# Altium project NixieMultimeterFront.PrjPcb
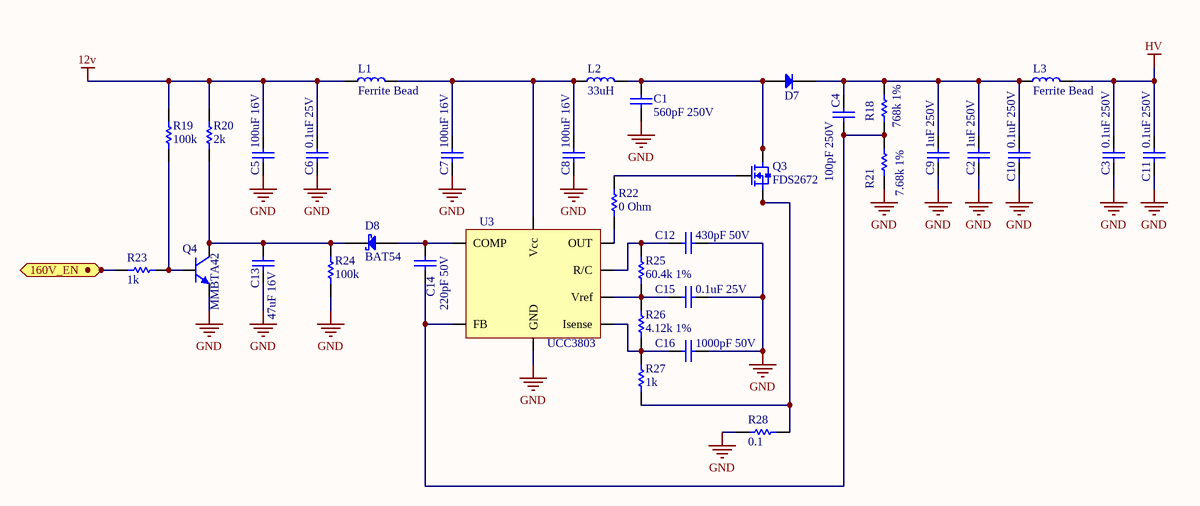
[diagram p0: Boost.SchDoc]
2 sheets, 45 parts. Net scope: flat (ports and power ports of the same name join across sheets).
Sheets:
  Boost.SchDoc
  Nixie.SchDoc

## Sheet Boost.SchDoc
size A

### Parts
C1  560pF 250V  [C0603]
C2  1uF 250V  [C2220]
C3  0.1uF 250V  [C0805]
C4  100pF 250V  [C0805]
C5  100uF 16V  [C1210]
C6  0.1uF 25V  [C0805]
C7  100uF 16V  [C1210]
C8  100uF 16V  [C1210]
C9  1uF 250V  [C2220]
C10  0.1uF 250V  [C0805]
C11  0.1uF 250V  [C0805]
C12  430pF 50V  [C0805]
C13  47uF 16V  [C1206]
C14  220pF 50V  [C0805]
C15  0.1uF 25V  [C0805]
C16  1000pF 50V  [C0805]
D7  Diode  [SMA]  (value not drawn)
D8  BAT54  [SOD-323]
L1  Ferrite Bead  [R0805]
L2  33uH  [Wurth 7447709330]
L3  Ferrite Bead  [R0805]
Q3  FDS2672  [8-SOIC]
Q4  MMBTA42  [SOT_23]
R18  768k 1%  [R0805]
R19  100k  [R0603]
R20  2k  [R0805]
R21  7.68k 1%  [R0805]
R22  0 Ohm  [R0805]
R23  1k  [R0805]
R24  100k  [R0603]
R25  60.4k 1%  [R0805]
R26  4.12k 1%  [R0805]
R27  1k  [R0805]
R28  0.1  [R0805]
U3  UCC3803  [8-SOIC]

### Ports
160V_EN

### Nets
12v: C5.2 C6.2 L1.1 R19.2 R20.2
GND: C1.1 C2.1 C3.1 C5.1 C6.1 C7.1 C8.1 C9.1 C10.1 C11.1 C12.2 C13.1 C15.2 C16.1 Q4.3(E) R21.1 R24.1 R28.1 U3.5(GND)
HV: C3.2 C11.2 L3.2
NetC1_2: C1.2 D7.1(A) L2.2 Q3.5 Q3.6 Q3.7 Q3.8
NetC2_2: C2.2 C4.2 C9.2 C10.2 D7.2(K) L3.1 R18.2
NetC4_1: C4.1 C14.1 R18.1 R21.2 U3.2(FB)
NetC7_2: C7.2 C8.2 L1.2 L2.1 U3.7(Vcc)
NetC12_1: C12.1 R25.1 U3.4(R/C)
NetC13_2: C13.2 D8.2(K) Q4.1(C) R20.1 R24.2
NetC14_2: C14.2 D8.1(A) U3.1(COMP)
NetC15_1: C15.1 R25.2 R26.1 U3.8(Vref)
NetC16_2: C16.2 R26.2 R27.1 U3.3(Isense)
NetQ3_1: Q3.1 Q3.2 Q3.3 R27.2 R28.2
NetQ3_4: Q3.4 R22.2
NetQ4_2: Q4.2(B) R19.1 R23.2
NetR22_1: R22.1 U3.6(OUT)
NetR23_1: R23.1 ; port 160V_EN

### Library data of the parts
C1 = 560pF 250V 0603: CAP CER 560PF 250V C0G/NP0 0603; Supplier 1: Digi-Key; Supplier Part Number 1: 399-11888-1-ND
C2 C9 = 1uF 250V 2220: CAP CER 1UF 250V X7R 2220; Supplier 1: Digi-Key; Supplier Part Number 1: 490-3550-1-ND
C3 C10 C11 = 0.1uF 250V 0805: CAP CER 0.1UF 250V X7T 0805; Supplier 1: Digi-Key; Supplier Part Number 1: 445-7965-1-ND
C4 = 100pF 250V 0805: CAP CER 100PF 250V C0G/NP0 0805; Supplier 1: Digi-Key; Supplier Part Number 1: 399-15000-1-ND
C5 C7 C8 = 100uF 16V 1210: CAP CER 100UF 16V X5R 1210; Supplier 1: Digi-Key; Supplier Part Number 1: 587-5426-1-ND
C6 C15 = 0.1uF 25V 0805: CAP CER 0.1UF 25V Y5V 0805; Supplier 1: Digi-Key; Supplier Part Number 1: 1276-1286-1-ND
C12 = 430pF 50V 0805: CAP CER 430PF 50V C0G/NP0 0805; Supplier 1: Digi-Key; Supplier Part Number 1: 1276-2659-1-ND
C13 = 47uF 16V 1206: CAP CER 47UF 16V JB 1206; Supplier 1: Digi-Key; Supplier Part Number 1: 445-11695-1-ND
C14 = 220pF 50V 0805: CAP CER 220PF 50V X7R 0805; Supplier 1: Digi-Key; Supplier Part Number 1: 399-8039-1-ND
C16 = 1000pF 50V 0805: CAP CER 1000PF 50V X7R 0805; Supplier 1: Digi-Key; Supplier Part Number 1: 399-1147-1-ND
D7 = Diode 200V 1A: DIODE GEN PURP 200V 1A SMA; Supplier 1: Digi-Key; Supplier Part Number 1: ES1DFSCT-ND
D8 = Diode 30V 100mA: DIODE BAT54 SCHOTTKY 30V 100MA SOD323; Supplier 1: Digi-Key; Supplier Part Number 1: BAT54WS-FDICT-ND
L1 L3 = Ferrite Bead 60 Ohm: FERRITE BEAD 60 OHM 0805 1LN; Supplier 1: Digi-Key; Supplier Part Number 1: 587-1932-1-ND
L2 = 33uH: FIXED IND 33UH 4.2A 45 MOHM SMD; Supplier 1: Digi-Key; Supplier Part Number 1: 732-1244-1-ND
Q3 = N-FET FDS2672: MOSFET N-CH 200V 3.9A 8-SOIC; Supplier 1: Digi-Key; Supplier Part Number 1: FDS2672CT-ND
Q4 = NPN 300V 0.3A: TRANS MMBTA42 NPN 300V 0.3A SOT23; Supplier 1: Digi-Key; Supplier Part Number 1: MMBTA42TPMSCT-ND
R18 = 768k 0805 1%: RES SMD 768K OHM 1% 1/8W 0805; Supplier 1: Digi-Key; Supplier Part Number 1: 311-768KCRCT-ND
R19 R24 = 100k 0603 5%: RES SMD 100K OHM 5% 1/10W 0603; Supplier 1: Digi-Key; Supplier Part Number 1: 311-100KGRCT-ND
R20 = 2k 0805 5%: RES SMD 2K OHM 5% 1/8W 0805; Supplier 1: Digi-Key; Supplier Part Number 1: RMCF0805JT2K00CT-ND
R21 = 7.68k 0805 1%: RES SMD 7.68K OHM 1% 1/8W 0805; Supplier 1: Digi-Key; Supplier Part Number 1: 311-7.68KCRCT-ND
R22 = 0 Ohm 0805: RES SMD 0 OHM JUMPER 1/8W 0805; Supplier 1: Digi-Key; Supplier Part Number 1: RMCF0805ZT0R00CT-ND
R23 R27 = 1k 0805 5%: RES SMD 1K OHM 5% 1/8W 0805; Supplier 1: Digi-Key; Supplier Part Number 1: RMCF0805JT1K00CT-ND
R25 = 60.4k 0805 1%: RES SMD 60.4K OHM 1% 1/8W 0805; Supplier 1: Digi-Key; Supplier Part Number 1: 311-60.4KCRCT-ND
R26 = 4.12k 0805 1%: RES SMD 4.12K OHM 1% 1/8W 0805; Supplier 1: Digi-Key; Supplier Part Number 1: 311-4.12KCRCT-ND
R28 = 0.1 0805 1%: RES 0.1 OHM 1% 1/2W 0805; Supplier 1: Digi-Key; Supplier Part Number 1: P19308CT-ND
U3 = UCC3803DTR: IC REG CTRLR MULT TOPOLOGY 8SOIC; Supplier 1: Digi-Key; Supplier Part Number 1: 296-38327-1-ND

## Sheet Nixie.SchDoc
size A
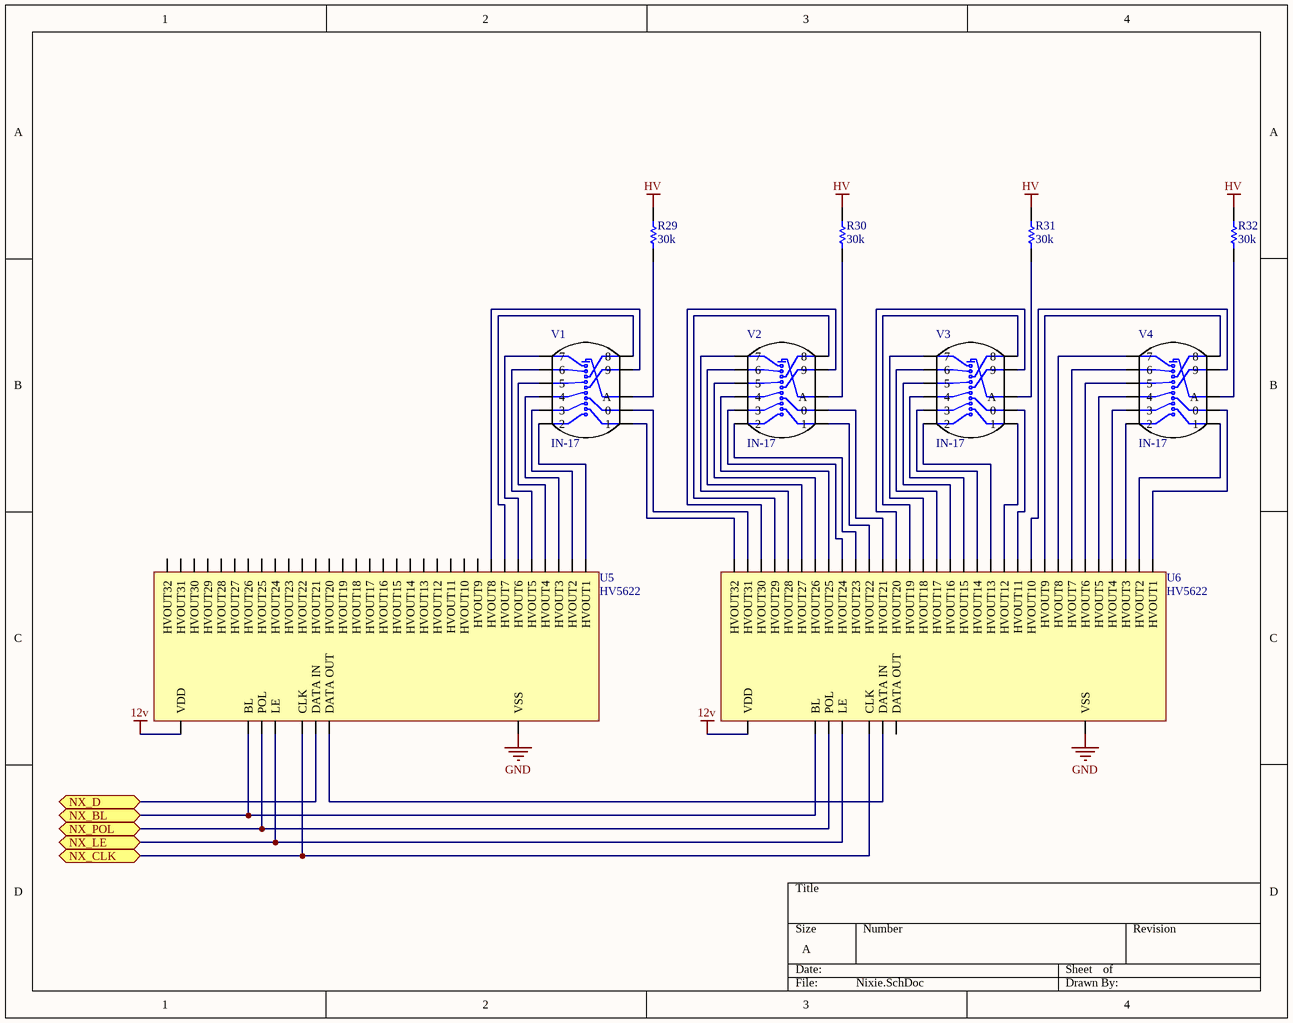
[diagram p1: Nixie.SchDoc]

### Parts
R29  30k  [R0805]
R30  30k  [R0805]
R31  30k  [R0805]
R32  30k  [R0805]
U5  HV5622  [44-PQFP]
U6  HV5622  [44-PQFP]
V1  IN-17  [IN-17]
V2  IN-17  [IN-17]
V3  IN-17  [IN-17]
V4  IN-17  [IN-17]

### Ports
NX_BL, NX_CLK, NX_D, NX_LE, NX_POL

### Nets
12v: U5.30(VDD) U6.30(VDD)
GND: U5.29(VSS) U6.29(VSS)
HV: R29.2 R30.2 R31.2 R32.2
NetR29_1: R29.1 V1.1(A)
NetR30_1: R30.1 V2.1(A)
NetR31_1: R31.1 V3.1(A)
NetR32_1: R32.1 V4.1(A)
NetU5_15: U5.15(HVOUT8) V1.11(9)
NetU5_16: U5.16(HVOUT7) V1.10(8)
NetU5_17: U5.17(HVOUT6) V1.9(7)
NetU5_18: U5.18(HVOUT5) V1.8(6)
NetU5_19: U5.19(HVOUT4) V1.7(5)
NetU5_20: U5.20(HVOUT3) V1.6(4)
NetU5_21: U5.21(HVOUT2) V1.5(3)
NetU5_22: U5.22(HVOUT1) V1.4(2)
NetU5_23: U5.23(DATA_OUT) U6.32(DATA_IN)
NetU5_27: U5.27(POL) U6.27(POL) ; port NX_POL
NetU5_28: U5.28(CLK) U6.28(CLK) ; port NX_CLK
NetU5_31: U5.31(LE) U6.31(LE) ; port NX_LE
NetU5_32: U5.32(DATA_IN) ; port NX_D
NetU5_33: U5.33(BL) U6.33(BL) ; port NX_BL
NetU6_1: U6.1(HVOUT22) V2.3(1)
NetU6_2: U6.2(HVOUT21) V2.2(0)
NetU6_3: U6.3(HVOUT20) V3.11(9)
NetU6_4: U6.4(HVOUT19) V3.10(8)
NetU6_5: U6.5(HVOUT18) V3.9(7)
NetU6_6: U6.6(HVOUT17) V3.8(6)
NetU6_7: U6.7(HVOUT16) V3.7(5)
NetU6_8: U6.8(HVOUT15) V3.6(4)
NetU6_9: U6.9(HVOUT14) V3.5(3)
NetU6_10: U6.10(HVOUT13) V3.4(2)
NetU6_11: U6.11(HVOUT12) V3.3(1)
NetU6_12: U6.12(HVOUT11) V3.2(0)
NetU6_13: U6.13(HVOUT10) V4.11(9)
NetU6_14: U6.14(HVOUT9) V4.10(8)
NetU6_15: U6.15(HVOUT8) V4.9(7)
NetU6_16: U6.16(HVOUT7) V4.8(6)
NetU6_17: U6.17(HVOUT6) V4.7(5)
NetU6_18: U6.18(HVOUT5) V4.6(4)
NetU6_19: U6.19(HVOUT4) V4.5(3)
NetU6_20: U6.20(HVOUT3) V4.4(2)
NetU6_21: U6.21(HVOUT2) V4.3(1)
NetU6_22: U6.22(HVOUT1) V4.2(0)
NetU6_35: U6.35(HVOUT32) V1.3(1)
NetU6_36: U6.36(HVOUT31) V1.2(0)
NetU6_37: U6.37(HVOUT30) V2.11(9)
NetU6_38: U6.38(HVOUT29) V2.10(8)
NetU6_39: U6.39(HVOUT28) V2.9(7)
NetU6_40: U6.40(HVOUT27) V2.8(6)
NetU6_41: U6.41(HVOUT26) V2.7(5)
NetU6_42: U6.42(HVOUT25) V2.6(4)
NetU6_43: U6.43(HVOUT24) V2.5(3)
NetU6_44: U6.44(HVOUT23) V2.4(2)

Not connected (* = marked no-connect by the designer): U5 1(HVOUT22) 2(HVOUT21) 3(HVOUT20) 4(HVOUT19) 5(HVOUT18) 6(HVOUT17) 7(HVOUT16) 8(HVOUT15) 9(HVOUT14) 10(HVOUT13) 11(HVOUT12) 12(HVOUT11) 13(HVOUT10) 14(HVOUT9) 35(HVOUT32) 36(HVOUT31) 37(HVOUT30) 38(HVOUT29) 39(HVOUT28) 40(HVOUT27) 41(HVOUT26) 42(HVOUT25) 43(HVOUT24) 44(HVOUT23); U6 23(DATA_OUT)

### Library data of the parts
R29-R32 = 30k 0805 5%: RES SMD 30K OHM 5% 1/8W 0805; Supplier 1: Digi-Key; Supplier Part Number 1: RMCF0805JT30K0CT-ND
U5 U6 = HV5622: IC 32BIT SRL PARALLEL 220V 44PQF; Supplier 1: Digi-Key; Supplier Part Number 1: HV5622PG-G-ND
V1-V4 = IN-17 Nixie: IN-17 Nixie Display Tube

## Nets that join several sheets
12v: Boost (5 pins), Nixie (U5.30 U6.30)
GND: Boost (19 pins), Nixie (U5.29 U6.29)
HV: Boost (C3.2 C11.2 L3.2), Nixie (R29.2 R30.2 R31.2 R32.2)